# EAGLE design ESP32_adapter_revC (EAGLE 7.3.0)
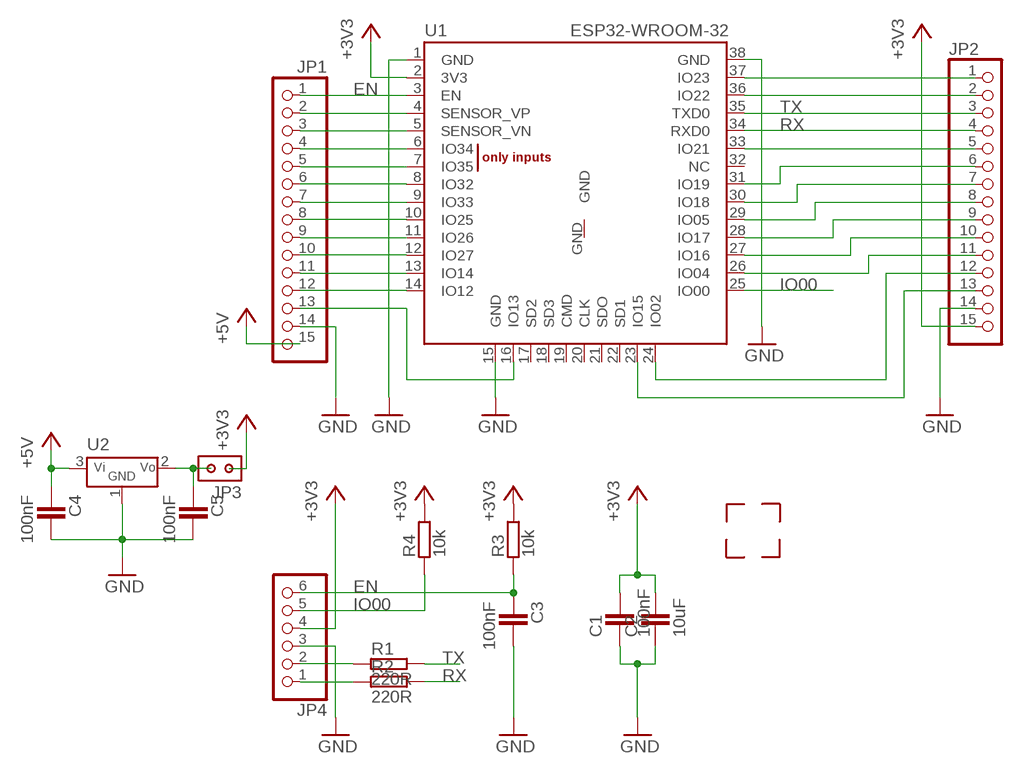
[diagram p0: schematic, sheet 1]

## Parts
C1  100nF  C-CERAMIC'SMD'  [C0805]
C2  10uF  C-CERAMIC'SMD'  [C0805]
C3  100nF  C-CERAMIC'SMD'  [C0805]
C4  100nF  C-CERAMIC'SMD'  [C0805]
C5  100nF  C-CERAMIC'SMD'  [C0805]
JP1  PINHD-1X15  [1X15]
JP2  PINHD-1X15  [1X15]
JP3  PINHD-2X1  [PINHD-2X1]
JP4  PINHD-1X6  [1X06]
R1  220R  R'2'  [R0805]
R2  220R  R'2'  [R0805]
R3  10k  R'2'  [R0805]
R4  10k  R'2'  [R0805]
U1  ESP-WROOM-32  [ESP-WROOM-32]
U2  V_STAB'TS1117'  [SOT223]
U$1  CORNER  [CORNER]
U$2  CORNER  [CORNER]
U$3  CORNER  [CORNER]
U$4  CORNER  [CORNER]

## Nets
+3V3: C1.2 C2.2 JP2.15 JP3.2 JP4.4 R3.2 R4.2 U1.2(3V3)
+5V: C4.1 JP1.15 U2.3(VIN)
EN: C3.1 JP1.1 JP4.6 R3.1 U1.3(EN)
GND: C1.1 C2.1 C3.2 C4.2 C5.2 JP1.14 JP2.14 JP4.3 U1.1(GND) U1.15(GND) U1.38(GND) U2.1(GND)
IO00: JP4.5 R4.1 U1.25(IO00)
N$1: JP4.1 R2.1
N$2: JP4.2 R1.1
N$3: JP1.2 U1.4(SENSOR_VP)
N$4: JP1.3 U1.5(SENSOR_VN)
N$5: JP1.4 U1.6(IO34)
N$6: JP1.5 U1.7(IO35)
N$7: JP1.6 U1.8(IO32)
N$8: JP1.7 U1.9(IO33)
N$9: JP1.8 U1.10(IO25)
N$10: JP1.9 U1.11(IO26)
N$11: JP1.10 U1.12(IO27)
N$12: JP1.11 U1.13(IO14)
N$13: JP1.12 U1.14(IO12)
N$14: C5.1 JP3.1 U2.2(VOUT)
N$15: JP2.1 U1.37(IO23)
N$16: JP2.2 U1.36(IO22)
N$19: JP2.5 U1.33(IO21)
N$20: JP2.6 U1.31(IO19)
N$21: JP2.7 U1.30(IO18)
N$22: JP2.8 U1.29(IO05)
N$23: JP2.9 U1.28(IO17)
N$24: JP2.10 U1.27(IO16)
N$25: JP2.11 U1.26(IO04)
N$26: JP2.12 U1.24(IO02)
N$27: JP2.13 U1.23(IO15)
N$28: JP1.13 U1.16(IO13)
RX: JP2.4 R2.2 U1.34(RXD0)
TX: JP2.3 R1.2 U1.35(TXD0)
Unconnected: U1.17(SD2) U1.18(SD3) U1.19(CMD) U1.20(CLK) U1.21(SDO) U1.22(SD1) U1.32(NC) U1.GND

## Library data of the parts
C1-C5 = 1_domaci:C-CERAMIC
JP1 JP2 = 1_domaci:PINHD-1X15: PIN HEADER
JP3 = 1_domaci:PINHD-2X1
JP4 = 1_domaci:PINHD-1X6: PIN HEADER
R1-R4 = 1_domaci:R
U1 = 1_domaci:ESP-WROOM-32
U2 = 1_domaci:V_STAB
U$1-U$4 = 1_domaci:CORNER

## Board
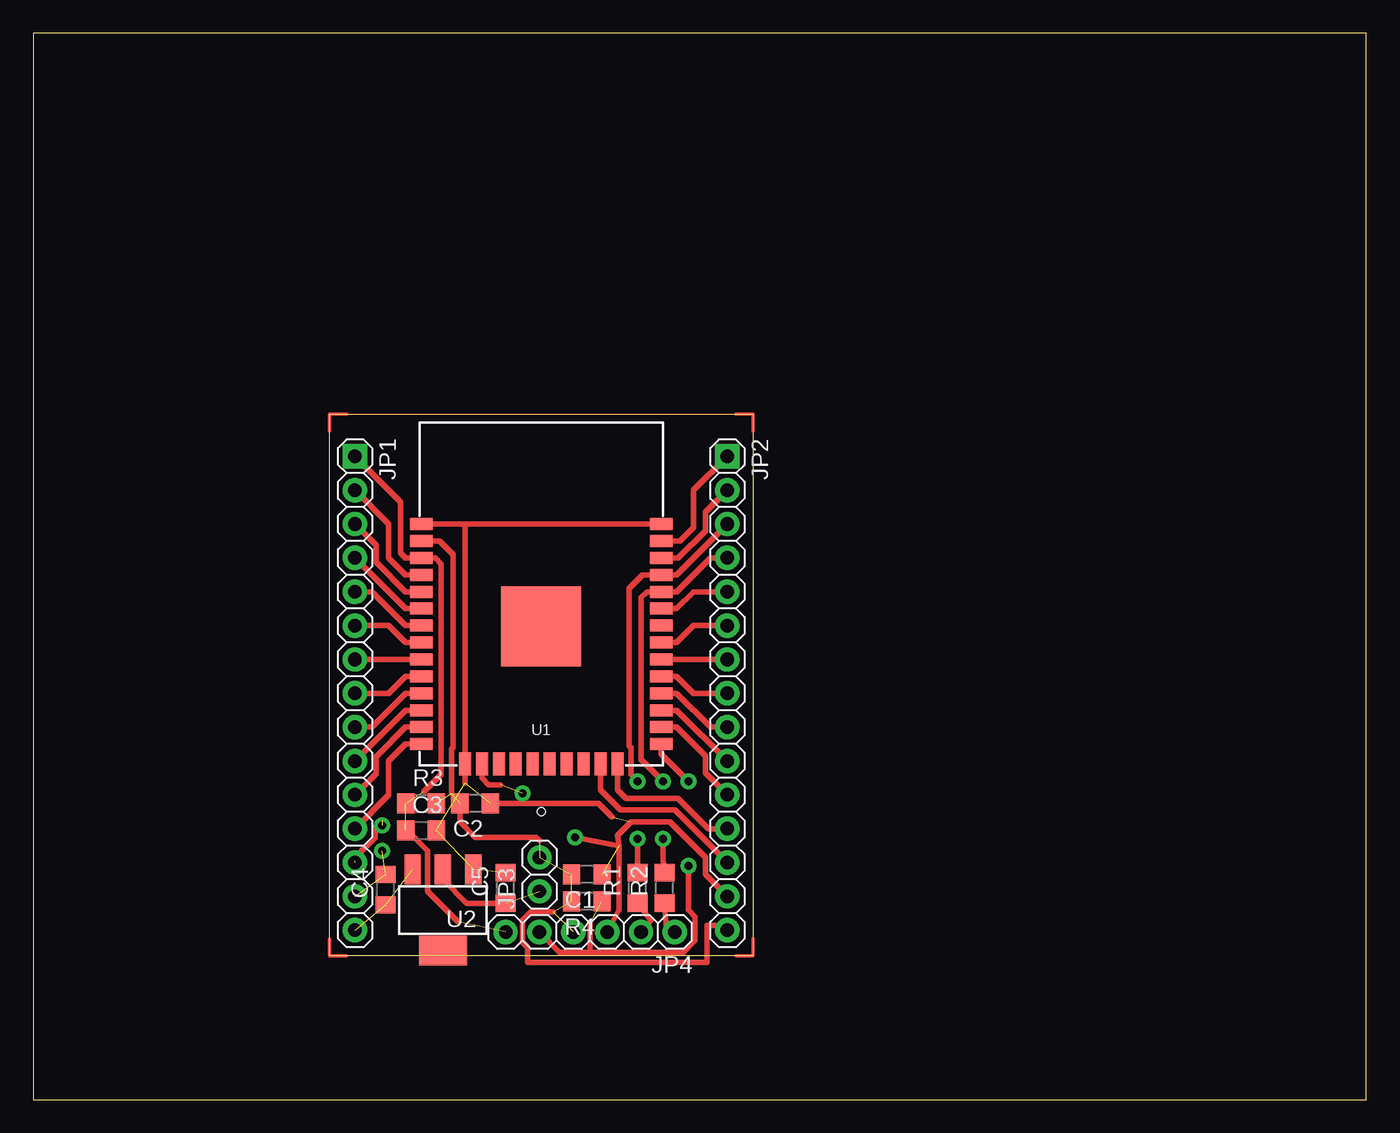
[diagram p1: board, top side]
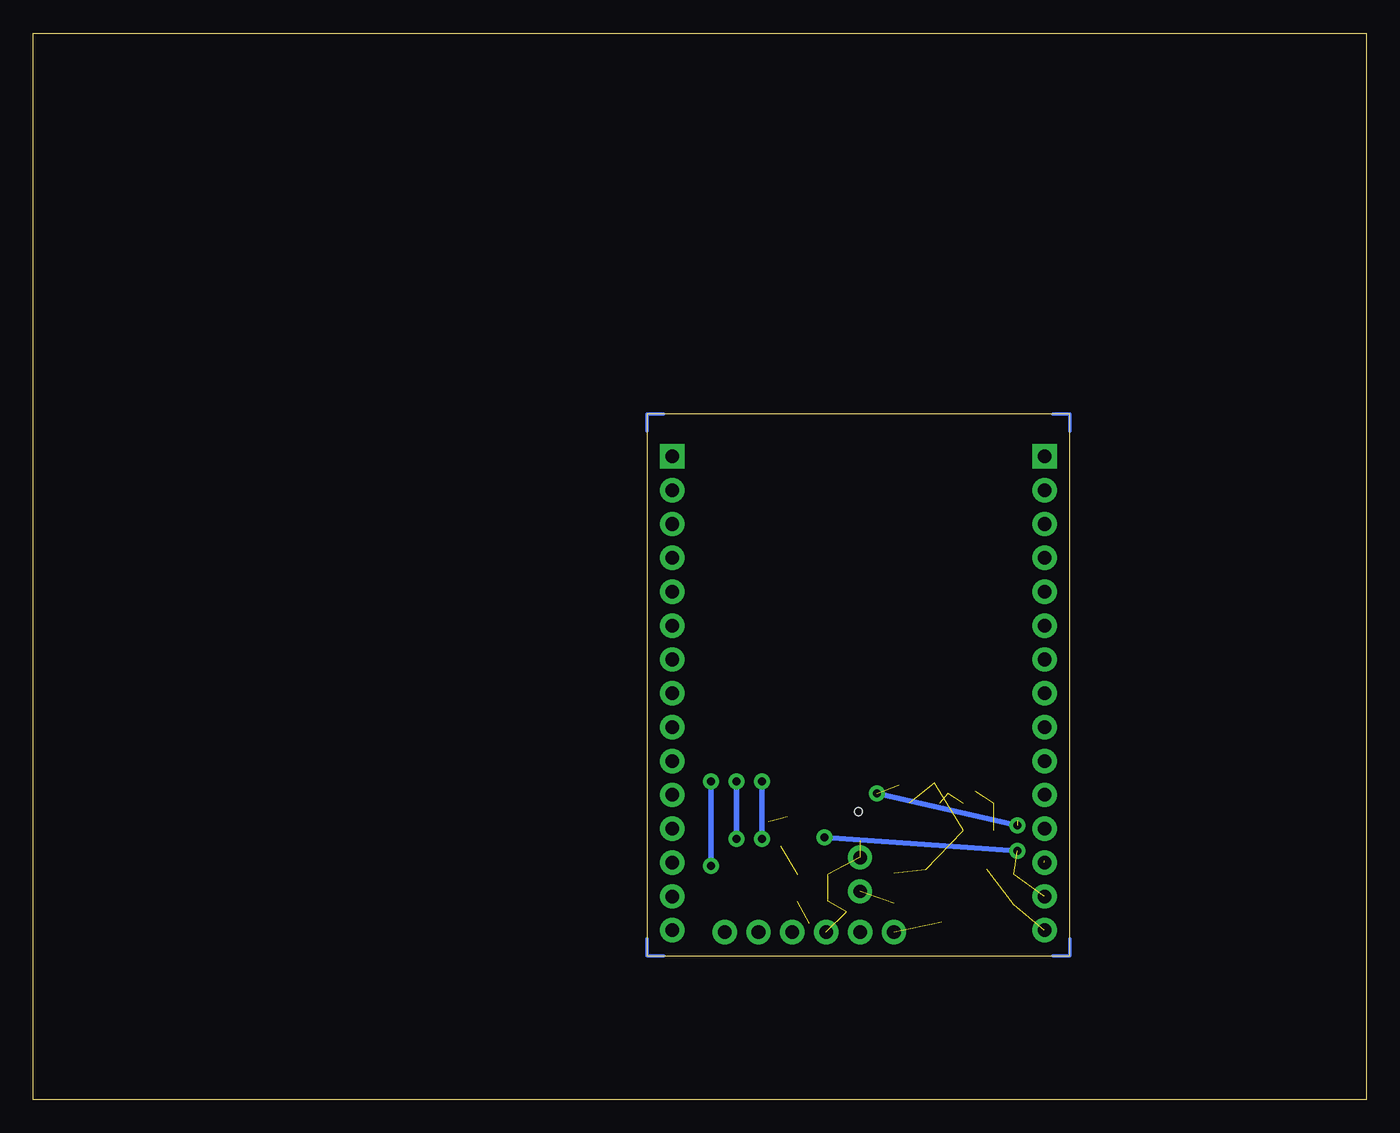
[diagram p2: board, bottom side, seen from below]

Size 100 x 80 mm. Coordinates in mm from the lower left corner, seen from the top.
Outline: 0,0 100,0 100,80 0,80 0,0
Outline: 22.23,51.44 53.98,51.44 53.98,10.79 22.23,10.79 22.23,51.44
Copper layers (1*16): Top 0.035mm / dielectric 1.5mm / Bottom 0.035mm
Design rules "default *": minimum track width 10mil, minimum drill 24mil, track to track 8mil, track to pad 8mil, pad to pad 8mil, via to via 8mil, smd to smd 8mil, copper to edge 40mil, drill to drill 8mil, minimum pad ring 10mil, minimum via ring 8mil, stop-mask expansion 4mil, vias tented up to drill 0mil, thermal gap 10mil
Holes 0.6 mm at 38.1,21.59

### Footprints (pad centres in the part's own frame; a part is rotated, then mirrored left to right if it is on the bottom)
C0805 = smd 1.3 x 1.5: 1 -1.143,0; 2 1.143,0
1X15 = drill 1.016 square: 1 -17.78,0 | drill 1.016: 2 -15.24,0; 3 -12.7,0; 4 -10.16,0; 5 -7.62,0; 6 -5.08,0; 7 -2.54,0; 8 0,0; 9 2.54,0; 10 5.08,0; 11 7.62,0; 12 10.16,0; 13 12.7,0; 14 15.24,0; 15 17.78,0
PINHD-2X1 = drill 1 pad 1.676: 1 -1.27,0; 2 1.27,0
1X06 = drill 1.016: 1 -6.35,0; 2 -3.81,0; 3 -1.27,0; 4 1.27,0; 5 3.81,0; 6 6.35,0
R0805 = smd 1.3 x 1.5: 1 -1.143,0; 2 1.143,0
ESP-WROOM-32 = smd 0.9 x 1.7: 1 7.7,9; 2 6.43,9; 3 5.16,9; 4 3.89,9; 5 2.62,9; 6 1.35,9; 7 0.08,9; 8 -1.19,9; 9 -2.46,9; 10 -3.73,9; 11 -5,9; 12 -6.27,9; 13 -7.54,9; 14 -8.81,9; 25 -8.81,-9; 26 -7.54,-9; 27 -6.27,-9; 28 -5,-9; 29 -3.73,-9; 30 -2.46,-9; 31 -1.19,-9; 32 0.08,-9; 33 1.35,-9; 34 2.62,-9; 35 3.89,-9; 36 5.16,-9; 37 6.43,-9; 38 7.7,-9 | smd 1.7 x 0.9: 15 -10.3,5.715; 16 -10.3,4.445; 17 -10.3,3.175; 18 -10.3,1.905; 19 -10.3,0.635; 20 -10.3,-0.635; 21 -10.3,-1.905; 22 -10.3,-3.175; 23 -10.3,-4.445; 24 -10.3,-5.715 | smd 6 x 6: GND 0,0
SOT223 = smd 1.219 x 2.235: 1 -2.286,-3.048; 2 0,-3.048; 3 2.286,-3.048 | smd 3.6 x 2.2: 4 0,3.048

### Placement (x,y rotation side)
C1  41.53,16.89 180 top
C2  33.15,22.23 180 top
C3  29.08,20.19 0 top
C4  26.42,15.75 90 top
C5  35.43,15.88 90 top
JP1  24.13,30.48 270 top
JP2  52.07,30.48 270 top
JP3  37.97,16.89 90 top
JP4  41.78,12.57 180 top
R1  45.34,15.88 90 top
R2  47.37,15.88 90 top
R3  29.08,22.23 0 top
R4  41.53,14.86 180 top
U1  38.1,35.48 90 top
U2  30.73,14.22 180 top
U$1  22.86,11.43 0 top
U$2  53.34,11.43 90 top
U$3  53.34,50.8 180 top
U$4  22.86,50.8 270 top

### Tracks (layer width: path | path; a pad name or v marks a point on that pad's centre or on a via)
+3V3  (7 unrouted)
  Top 0.406: U1.2 30.48,41.91 31.5,40.89 31.5,26.42 31.37,26.29 31.37,22.99 | JP2.15 51.69,13.08 50.55,13.08 50.55,10.29 37.08,10.29 37.08,11.43 36.7,11.81 36.7,13.46 37.34,14.1 38.99,14.1 | C2.2 32,20.83 33.15,19.68 37.72,19.68 37.97,19.43
+5V  (2 unrouted)
EN  (3 unrouted)
  Top 0.406: 29.34,23.11 30.61,24.38 30.61,40.2 30.16,40.64 U1.3 27.94,40.64 27.56,41.02 27.56,44.83 JP1.1 | C3.1 28.07,20.19 29.59,18.67 29.59,15.62 31.88,13.34
GND  (via drill 0.6)  (8 unrouted)
  Top 0.406: U1.1 32.38,43.18 | 32.38,43.18 U1.38 | 32.38,43.18 U1.15 32.38,23.75 | JP2.14 50.42,16.89 50.42,18.16 47.75,20.83 44.83,20.83 43.81,19.81 43.94,19.05 | JP4.3 43.94,14.22 43.94,19.05 | v40.64,19.68 43.94,19.05 | C2.1 42.42,22.23 43.43,21.21
  Bottom 0.406: v26.16,18.67 v40.64,19.68
IO00  (via drill 0.6)  (1 unrouted)
  Top 0.406: U1.25 47.1,25.93 v49.15,23.88 | v49.15,17.53 49.15,14.22 49.66,13.72 49.66,11.94 48.77,11.05 41.78,11.05 | 41.78,11.05 39.5,11.05 JP4.5 | 41.78,11.05 41.78,13.21
  Bottom 0.406: v49.15,23.88 v49.15,17.53
N$1
  Top 0.406: R2.1 47.5,12.7 JP4.1
N$2
  Top 0.406: R1.1 46.35,13.46 JP4.2
N$3
  Top 0.406: U1.4 27.94,39.37 26.67,40.64 26.67,43.18 JP1.2
N$4
  Top 0.406: U1.5 27.94,38.1 25.72,40.32 25.72,41.59 JP1.3
N$5
  Top 0.406: JP1.4 27.94,36.83 U1.6
N$6
  Top 0.406: U1.7 27.94,35.56 25.4,38.1 JP1.5
N$7
  Top 0.406: U1.8 27.94,34.29 26.67,35.56 JP1.6
N$8
  Top 0.406: JP1.7 U1.9
N$9
  Top 0.406: U1.10 27.94,31.75 26.67,30.48 JP1.8
N$10
  Top 0.406: U1.11 27.94,30.48 25.4,27.94 JP1.9
N$11
  Top 0.406: U1.12 27.94,29.21 JP1.10
N$12
  Top 0.406: U1.13 27.94,27.94 25.72,25.72 25.72,24.45 JP1.11
N$13
  Top 0.406: U1.14 27.94,26.67 26.67,25.4 26.67,22.86 JP1.12
N$14  (1 unrouted)
  Top 0.406: U2.2 30.73,16.51 32.51,14.73 C5.1
N$15
  Top 0.406: U1.37 48.51,41.91 49.53,42.93 49.53,45.72 JP2.1
N$16
  Top 0.406: U1.36 48.39,40.64 50.42,42.67 50.42,44.07 JP2.2
N$19
  Top 0.406: U1.33 48.26,36.83 49.53,38.1 JP2.5
N$20
  Top 0.406: U1.31 48.26,34.29 49.53,35.56 JP2.6
N$21
  Top 0.406: U1.30 JP2.7
N$22
  Top 0.406: U1.29 48.26,31.75 49.53,30.48 JP2.8
N$23
  Top 0.406: U1.28 48.26,30.48 50.8,27.94 JP2.9
N$24
  Top 0.406: U1.27 48.26,29.21 JP2.10
N$25
  Top 0.406: U1.26 48.26,27.94 50.42,25.78 50.42,24.51 JP2.11
N$26
  Top 0.406: U1.24 43.81,23.24 44.45,22.61 48.39,22.61 50.67,20.32 JP2.12
N$27
  Top 0.406: U1.23 42.55,23.24 44.07,21.72 48.13,21.72 JP2.13
N$28  (via drill 0.6)  (3 unrouted)
  Top 0.406: U1.16 33.66,24.13 34.16,23.62 35.05,23.62 | 24.13,17.91 24.13,18.16 25.65,19.68 25.65,20.45 26.16,20.95
  Bottom 0.406: v36.7,22.99 v26.16,20.57
RX  (via drill 0.6)
  Top 0.406: JP2.4 50.8,40.64 48.26,38.1 U1.34 46.04,38.1 45.59,37.66 45.59,25.53 v47.24,23.88 | v47.24,19.56 47.24,18.03 R2.2
  Bottom 0.406: v47.24,23.88 v47.24,19.56
TX  (via drill 0.6)
  Top 0.406: JP2.3 48.26,39.37 U1.35 45.72,39.37 44.7,38.35 44.7,26.54 44.83,26.42 44.83,24.38 v45.34,23.88 | R1.2 v45.34,19.56
  Bottom 0.406: v45.34,23.88 v45.34,19.56